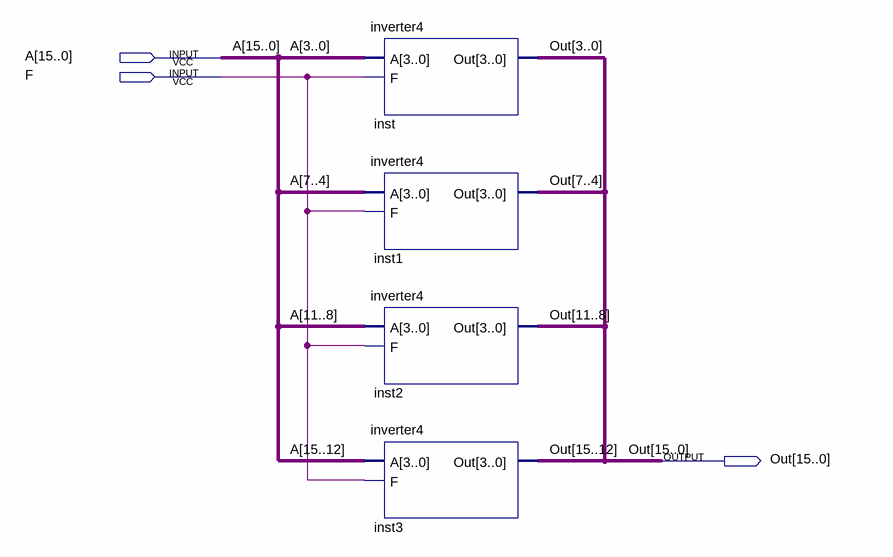
[diagram p0: schematic sheet]
// Quartus schematic inverter16.bdf as structural Verilog: 4 symbols, 3 pins
module inverter16 (
  input  [15:0] A,
  input  F,
  output [15:0] Out
);

  inverter4 inst (.A(A[3:0]), .F(F), .Out(Out[3:0]));
  inverter4 inst1 (.A(A[7:4]), .F(F), .Out(Out[7:4]));
  inverter4 inst2 (.A(A[11:8]), .F(F), .Out(Out[11:8]));
  inverter4 inst3 (.A(A[15:12]), .F(F), .Out(Out[15:12]));
endmodule
